# EAGLE design PIR_Sensor_Card (EAGLE 6.4)

## Sheet 1 of 2
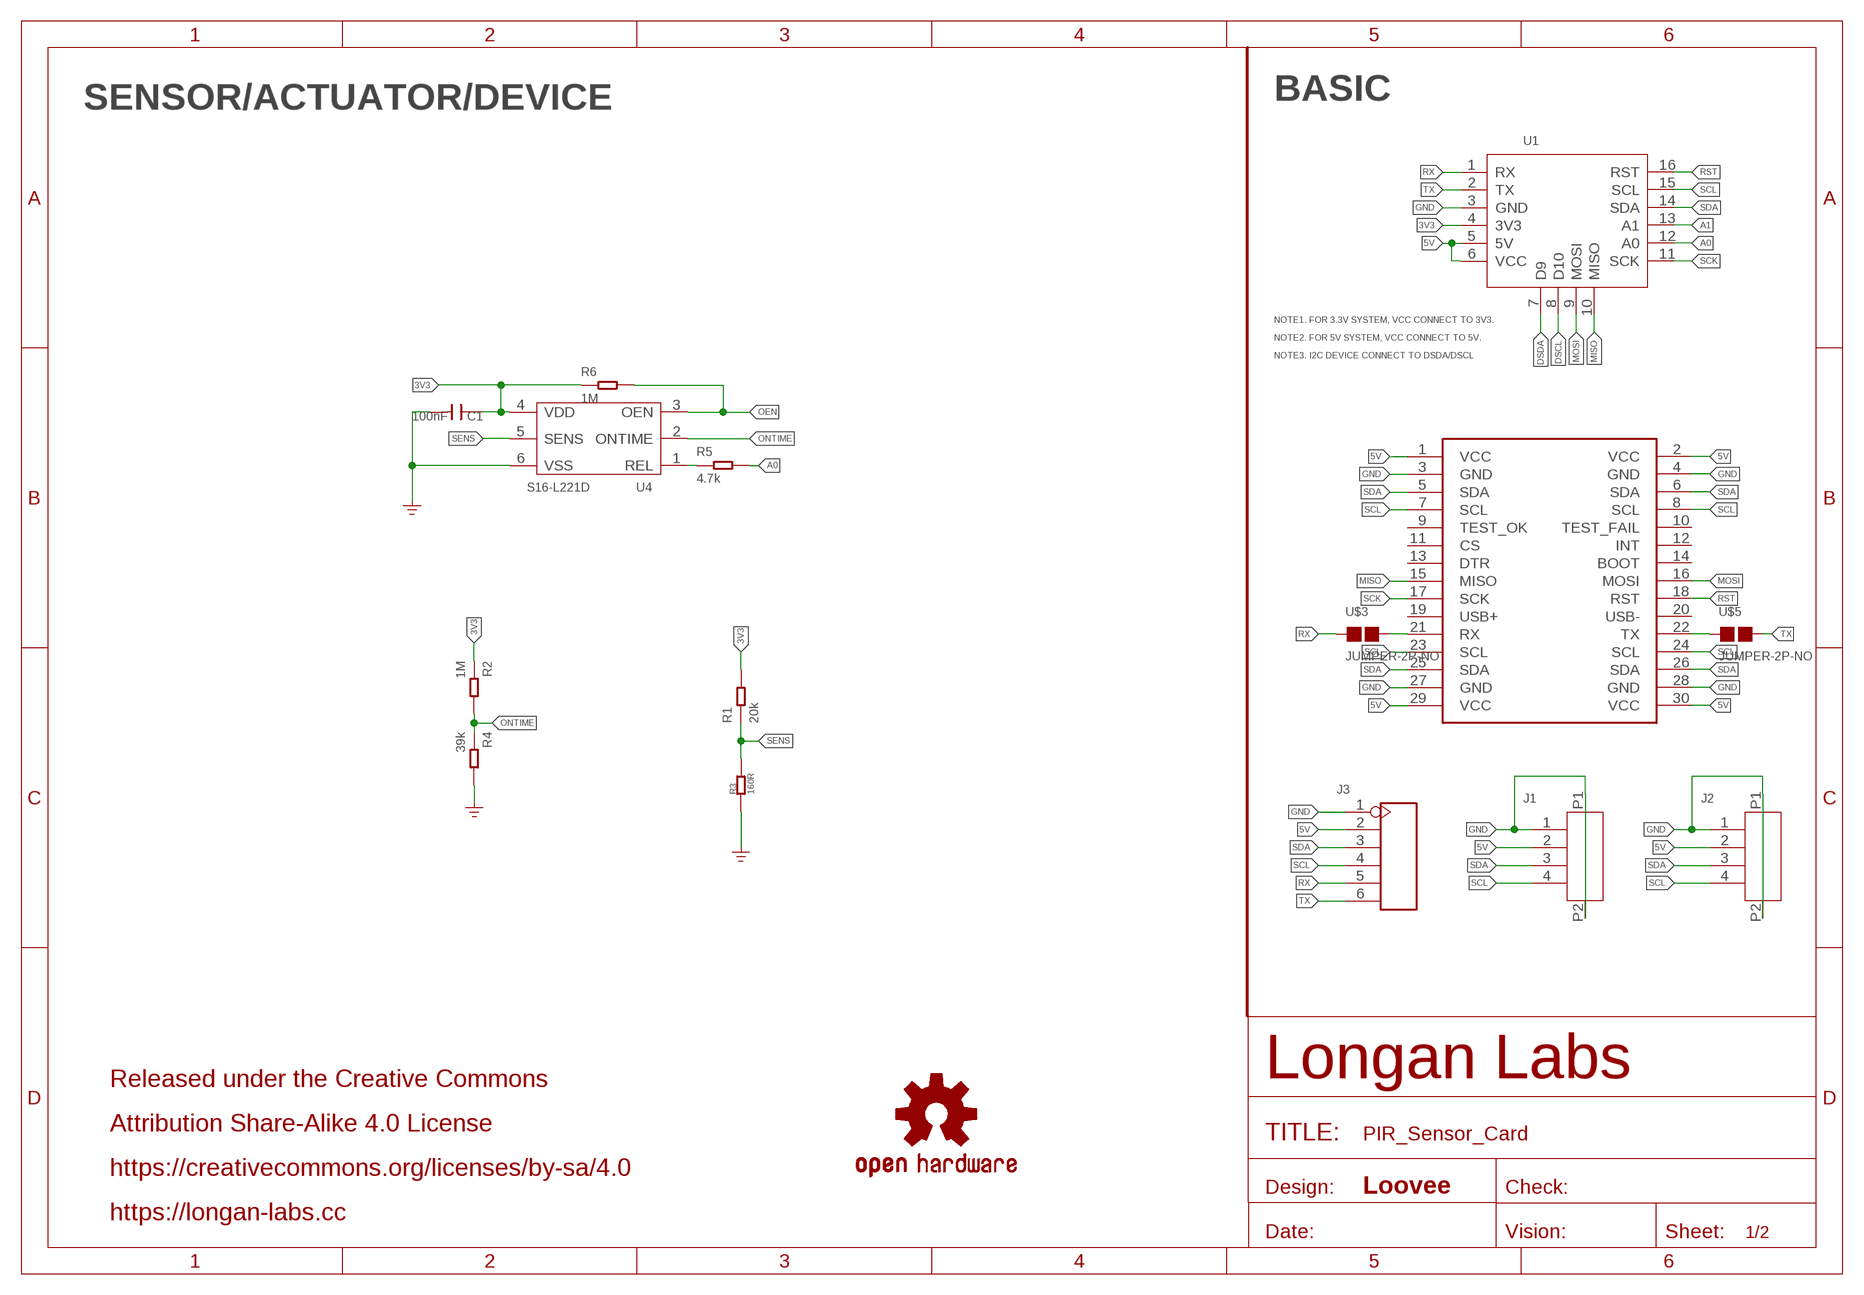
[diagram p0: schematic, sheet 1]

### Parts
C1  100nF  CAP-0603  [C0603]
J1  HEADER-4P-1.0  [4P-1.0-90D]
J2  HEADER-4P-1.0  [4P-1.0-90D]
J3  HEADER-6P-55/35MIL  [H6-2.54]
LOGO2  OSHW-LOGOS  [OSHW-LOGO-S]
MOUDLE1  MOUDLE-2X15P-2.54'BOARD'  [MOUDLE-2X15P-2.54]
R1  20k  RES-0603  [R0603]
R2  1M  RES-0603  [R0603]
R3  160R  RES-0603  [R0603]
R4  39k  RES-0603  [R0603]
R5  4.7k  RES-0603  [R0603]
R6  1M  RES-0603  [R0603]
U1  MOUDLE-CARDS  [16P-2.0-CARDS]
U4  S16-L221D  [6P-SMD-6X6MM]
U$3  JUMPER-2P-NO  [2P-SMD-NO]
U$5  JUMPER-2P-NO  [2P-SMD-NO]

### Nets
3V3: C1.1 R1.2 R2.1 R6.1 U1.4(3V3) U4.4(VDD)
5V: J1.2 J2.2 J3.2 MOUDLE1.1(VCC) MOUDLE1.2(VCC) MOUDLE1.29(VCC) MOUDLE1.30(VCC) U1.5(5V) U1.6(VCC)
A0: R5.2 U1.12(A0)
A1: U1.13(A1)
DSCL: U1.8(D10)
DSDA: U1.7(D9)
GND: C1.2 J1.1 J1.P1 J1.P2 J2.1 J2.P1 J2.P2 J3.1 MOUDLE1.3(GND) MOUDLE1.4(GND) MOUDLE1.27(GND) MOUDLE1.28(GND) R3.1 R4.2 U1.3(GND) U4.6(VSS) ; supply symbol labelled GND_POWER
MISO: MOUDLE1.15(MISO) U1.10(MISO)
MOSI: MOUDLE1.16(MOSI) U1.9(MOSI)
N$1: R5.1 U4.1(REL)
N$2: MOUDLE1.21(RX) U$3.2
N$3: MOUDLE1.22(TX) U$5.1
OEN: R6.2 U4.3(OEN)
ONTIME: R2.2 R4.1 U4.2(ONTIME)
RST: MOUDLE1.18(RST) U1.16(RST)
RX: J3.5 U1.1(RX) U$3.1
SCK: MOUDLE1.17(SCK) U1.11(SCK)
SCL: J1.4 J2.4 J3.4 MOUDLE1.7(SCL) MOUDLE1.8(SCL) MOUDLE1.23(SCL) MOUDLE1.24(SCL) U1.15(SCL)
SDA: J1.3 J2.3 J3.3 MOUDLE1.5(SDA) MOUDLE1.6(SDA) MOUDLE1.25(SDA) MOUDLE1.26(SDA) U1.14(SDA)
SENS: R1.1 R3.2 U4.5(SENS)
TX: J3.6 U1.2(TX) U$5.2
Unconnected: MOUDLE1.9(TEST_OK) MOUDLE1.10(TEST_FAIL) MOUDLE1.11(CS) MOUDLE1.12(INT) MOUDLE1.13(DTR) MOUDLE1.14(BOOT) MOUDLE1.19(USB+) MOUDLE1.20(USB-)

### Notes on the sheet
- SENSOR/ACTUATOR/DEVICE | BASIC
- NOTE1. FOR 3.3V SYSTEM, VCC CONNECT TO 3V3.
- NOTE2. FOR 5V SYSTEM, VCC CONNECT TO 5V.
- NOTE3. I2C DEVICE CONNECT TO DSDA/DSCL
- Released under the Creative Commons
- Attribution Share-Alike 4.0 License
- https://creativecommons.org/licenses/by-sa/4.0
- Loovee
- https://longan-labs.cc

## Sheet 2 of 2

## Library data of the parts
C1 = Discrete-new:CAP: Ceramic Capacitors
J1 J2 = Longan-Connect:HEADER-4P-1.0
J3 = Connector-new:HEADER-6P
LOGO2 = SparkFun-Aesthetics:OSHW-LOGO: Open-Source Hardware (OSHW) Logo This logo indicates the piece of hardware it is found on incorporates a OSHW license and/or adheres to the definition of open source hardware found here: http://freedomdefined.org/OSHW
MOUDLE1 = Longan-moudle:MOUDLE-2X15P-2.54
R1-R6 = Discrete-new:RES
U1 = MOUDLE-CARDS:MOUDLE-CARDS
U4 = template:S16-L221D
U$3 U$5 = Discrete-new:JUMPER-2P-NO

## Board
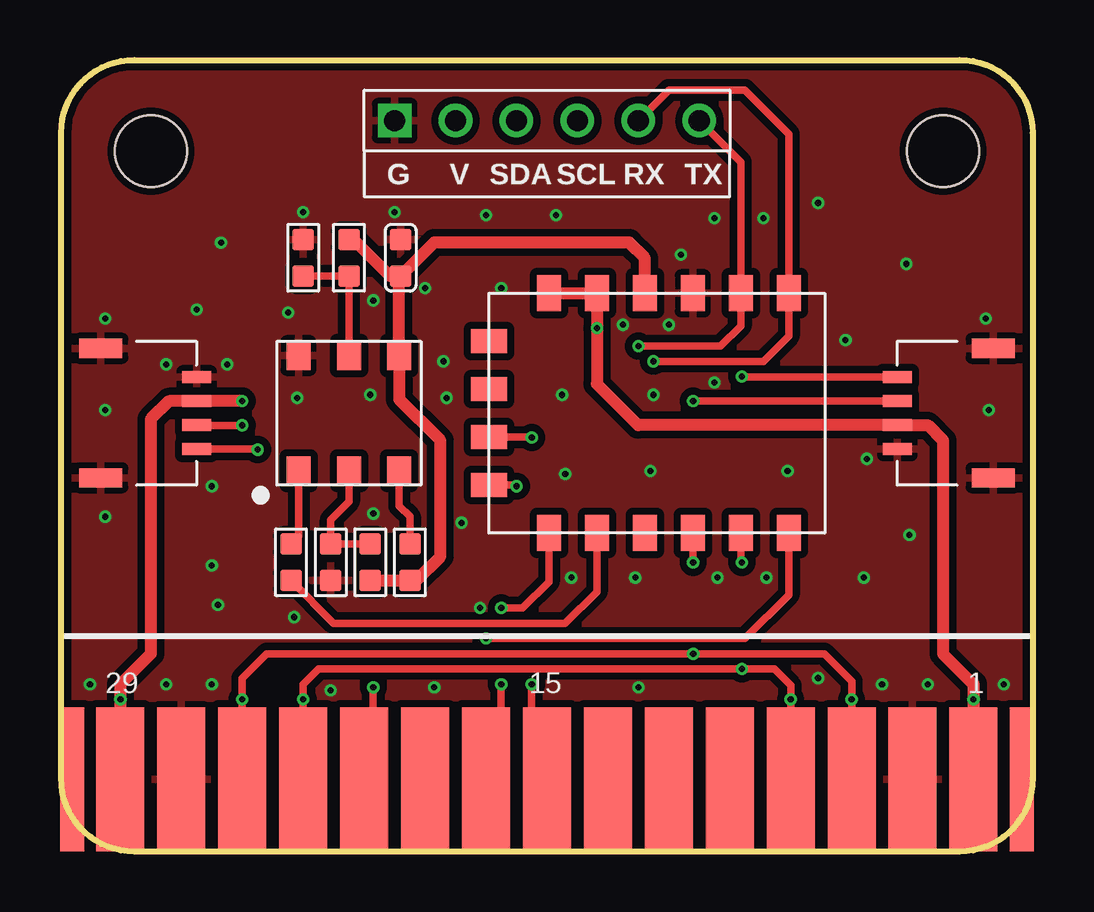
[diagram p1: board, top side]
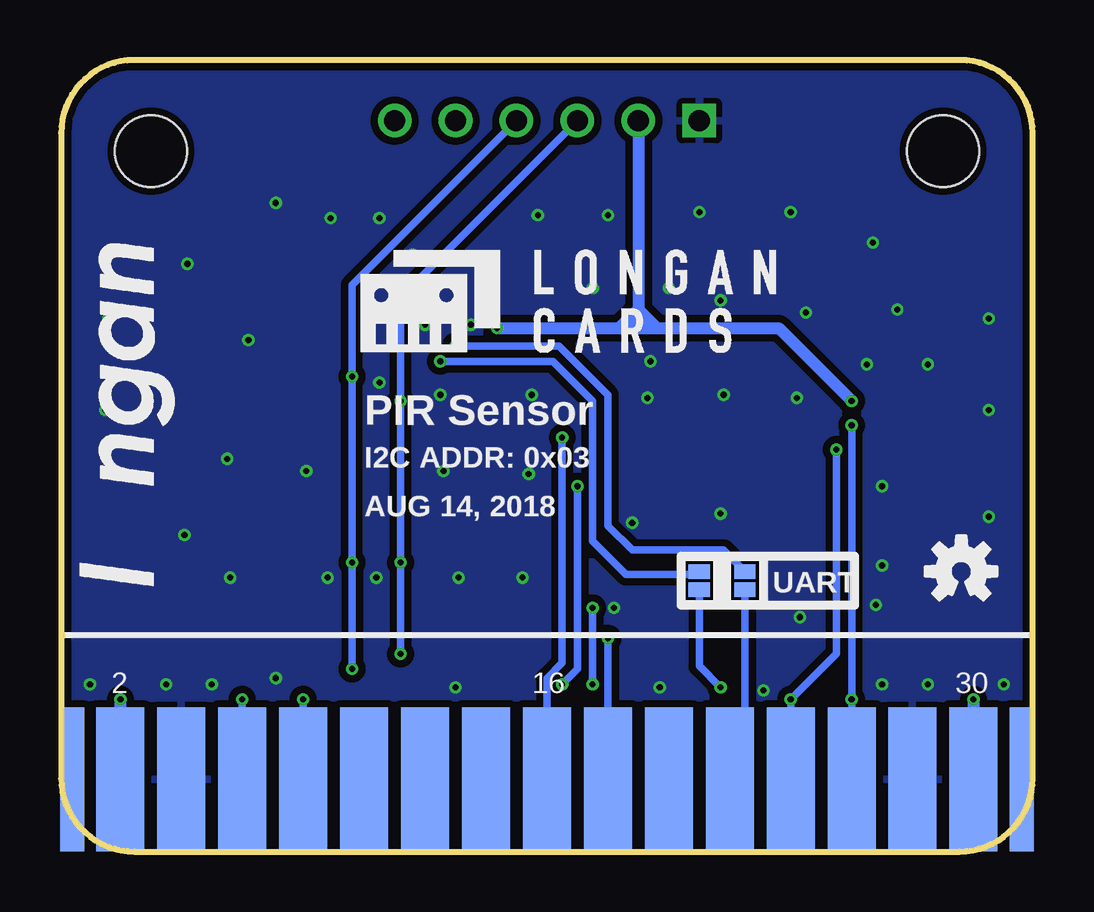
[diagram p2: board, bottom side, seen from below]

Size 40.5 x 33 mm. Coordinates in mm from the lower left corner, seen from the top.
Copper layers (1*16): Top 0.035mm / dielectric 1.5mm / Bottom 0.035mm
Design rules "SeeedStudio_2layer_DRU_no_angle_20140221": minimum track width 1mil, minimum drill 10mil, track to track 6mil, track to pad 6mil, pad to pad 6mil, via to via 6mil, smd to smd 0mil, copper to edge 10mil, drill to drill 10mil, minimum pad ring 4mil, minimum via ring 4mil, stop-mask expansion 2mil, vias tented up to drill 25mil, thermal gap 10mil

### Footprints (pad centres in the part's own frame; a part is rotated, then mirrored left to right if it is on the bottom)
C0603 = smd 0.889 x 0.889: 1 0,0.762; 2 0,-0.762
4P-1.0-90D = smd 1.2 x 0.5: 1 0,1.5; 2 0,0.5; 3 0,-0.5; 4 0,-1.5 | smd 1.8 x 0.8: P1 -4,2.7; P2 -4,-2.7
H6-2.54 = drill 0.889 pad 1.397 square: 1 0,6.35 | drill 0.889 pad 1.397: 2 0,3.81; 3 0,1.27; 4 0,-1.27; 5 0,-3.81; 6 0,-6.35
MOUDLE-2X15P-2.54 = smd 2 x 6: 1 17.78,-13.492; 3 15.24,-13.492; 5 12.7,-13.492; 7 10.16,-13.492; 9 7.62,-13.492; 11 5.08,-13.492; 13 2.54,-13.492; 15 0,-13.492; 17 -2.54,-13.492; 19 -5.08,-13.492; 21 -7.62,-13.492; 23 -10.16,-13.492; 25 -12.7,-13.492; 27 -15.24,-13.492; 29 -17.78,-13.492 | smd 2 x 6 bottom: 2 17.78,-13.492; 4 15.24,-13.492; 6 12.7,-13.492; 8 10.16,-13.492; 10 7.62,-13.492; 12 5.08,-13.492; 14 2.54,-13.492; 16 0,-13.492; 18 -2.54,-13.492; 20 -5.08,-13.492; 22 -7.62,-13.492; 24 -10.16,-13.492; 26 -12.7,-13.492; 28 -15.24,-13.492; 30 -17.78,-13.492 | smd 1 x 6: P1 -19.8,-13.492; P4 19.8,-13.492 | smd 1 x 6 bottom: P2 -19.8,-13.492; P3 19.8,-13.492 | hole 3: -16.51,12.7; 16.51,12.7
R0603 = smd 0.889 x 0.889: 1 0,0.762; 2 0,-0.762
16P-2.0-CARDS = smd 1.5 x 1: 1 -5,5; 2 -5,3; 3 -5,1; 4 -5,-1; 5 -5,-3; 6 -5,-5; 11 5,-5; 12 5,-3; 13 5,-1; 14 5,1; 15 5,3; 16 5,5 | smd 1 x 1.5: 7 -3,-7.5; 8 -1,-7.5; 9 1,-7.5; 10 3,-7.5
6P-SMD-6X6MM = smd 1.2 x 1: 1 -2.4,2.1; 2 -2.4,0; 3 -2.4,-2.1; 4 2.4,-2.1; 5 2.4,0; 6 2.4,2.1
2P-SMD-NO = smd 0.889 x 0.61: 1 0,0.381; 2 0,-0.381

### Placement (x,y rotation side)
C1  14.15,24.76 180 top
J1  5.64,18.28 0 top
J2  34.86,18.28 180 top
J3  20.25,30.47 90 top
LOGO2  2.98,11.67 0 bottom
MOUDLE1  20.25,16.5 0 top
R1  11.99,24.76 180 top
R2  12.88,12.05 180 top
R3  10.09,24.76 0 top
R4  11.23,12.05 0 top
R5  9.58,12.05 0 top
R6  14.54,12.05 180 top
U1  25.33,18.28 270 top
U4  11.99,18.28 90 top
U$1  [LONGAN-CARDS-MIDDLE]  28.76,20.31 0 bottom
U$3  13.9,11.29 0 bottom
U$5  11.99,11.29 180 bottom
U$7  [LONGAN-COPPER-SMALLER]  34.6,9.77 90 bottom

### Tracks (layer width: path | path; a pad name or v marks a point on that pad's centre or on a via)
3V3
  Top 0.508: C1.1 14.09,23.81 U4.4 14.09,18.84 15.8,17.14 15.8,12.31 14.79,11.29 R6.1 R2.1 | U1.4 24.33,24.74 23.68,25.39 15.55,25.39 C1.1 | R1.2 12.19,25.52 13.71,23.99 C1.1
5V  (via drill 0.25 pad 0.51)
  Top 0.508: 22.28,23.23 U1.5 | U1.6 U1.5 | MOUDLE1.2 v38.03,6.34 38.03,6.97 36.76,8.24 36.76,17.14 36.12,17.78 J2.2 24.05,17.78 22.33,19.5 v22.33,21.82 U1.5 | MOUDLE1.30 v2.47,6.34 2.47,6.97 3.74,8.24 3.74,18.02 4.49,18.78 J1.2 5.65,18.79 v7.55,18.79
  Bottom 0.508: v38.03,6.34 MOUDLE1.2 | v2.47,6.34 MOUDLE1.30 | v22.33,21.82 16.44,21.82 | 16.44,21.82 10.58,21.82 v7.55,18.79 | J3.2 16.44,22.47 | 16.44,22.47 16.44,21.82 | 16.44,22.47 16.57,22.47 17.2,21.83 | 16.44,22.47 16.31,22.47 15.68,21.83
A0
  Top 0.305: U1.12 22.33,10.83 21.01,9.52 11.36,9.52 R5.2
GND  (via drill 0.25 pad 0.51)
  other vias: 4.38,6.97 6.28,6.97 1.2,6.97 34.22,6.97 36.12,6.97 39.3,6.97 24.7,19.04 27.23,19.55 33.59,16.37 38.66,18.41 35.36,13.2 38.54,22.21 32.7,21.33 27.23,26.41 25.84,24.88 20.63,26.53 17.71,26.53 13.9,26.66 10.09,26.66 15.17,23.48 18.34,23.48 25.33,21.96 23.43,21.96 20.89,19.04 13.01,22.98 1.84,18.41 6.91,20.31 1.84,22.21 4.38,20.31 1.84,13.96 6.28,15.23 6.28,11.93 21.27,11.42 23.93,11.42 27.36,11.42 29.39,11.42 33.46,11.42 30.28,15.87 24.57,15.87 21.01,15.74 9.46,22.47 6.66,25.39 5.64,22.6 31.55,27.04 35.24,24.5 15.93,20.44 16.06,18.91 9.84,18.91 12.88,19.04 16.69,13.71 13.01,14.09 9.71,9.77 6.53,10.28 29.27,26.41 24.06,6.85 17.46,10.15 15.55,6.85 11.23,6.72 31.55,7.23
  pour Top (isolate 0.305): -0.2,33.01 41.2,33.01 41.2,-0.01 -0.2,-0.01
  pour Bottom (isolate 0.305): -0.2,33.01 41.2,33.01 41.2,-0.01 -0.2,-0.01
MISO  (via drill 0.25 pad 0.51)
  Top 0.305: U1.10 18.93,15.28 v18.98,15.23 | v19.61,6.97 19.61,3.64 MOUDLE1.15
  Bottom 0.305: v18.98,15.23 18.98,7.61 v19.61,6.97
MOSI  (via drill 0.25 pad 0.51)
  Top 0.305: U1.9 19.6,17.28 v19.61,17.26
  Bottom 0.305: v19.61,17.26 19.61,7.86 20.25,7.23 MOUDLE1.16
N$1
  Top 0.305: U4.1 9.89,13.13 R5.1
N$2  (via drill 0.25 pad 0.51)
  Top 0.305: v13.01,6.85 13.01,3.39 MOUDLE1.21
  Bottom 0.305: U$3.2 13.9,7.74 v13.01,6.85
N$3
  Bottom 0.305: U$5.1 11.99,3.64 MOUDLE1.22
OEN
  Top 0.305: U4.3 14.09,14.4 14.54,13.96 R6.2
ONTIME
  Top 0.305: R2.2 R4.1 11.23,13.83 11.99,14.6 U4.2
RST  (via drill 0.25 pad 0.51)
  Top 0.305: U1.16 30.33,10.71 28.51,8.88 v17.71,8.88
  Bottom 0.305: v17.71,8.88 MOUDLE1.18
RX  (via drill 0.25 pad 0.51)
  Top 0.305: J3.5 25.33,31.74 28.51,31.74 30.33,29.91 U1.1 30.33,21.5 29.27,20.44 v24.7,20.44
  Bottom 0.305: v24.7,20.44 20,20.44 18.34,18.79 18.34,12.94 16.95,11.55 14.03,11.55 U$3.1
SCK  (via drill 0.25 pad 0.51)
  Top 0.305: U1.11 20.33,11.25 19.23,10.15 v18.34,10.15 | v18.34,6.97 18.34,3.64 MOUDLE1.17
  Bottom 0.305: v18.34,10.15 v18.34,6.97
SCL  (via drill 0.25 pad 0.51)
  Top 0.305: MOUDLE1.8 v30.41,6.34 30.41,6.93 29.73,7.61 v28.38,7.61 10.72,7.61 10.09,6.97 v10.09,6.34 MOUDLE1.23 | U1.15 28.33,12.1 v28.38,12.05 | J2.4 28.4,19.78 v28.38,19.8 | J1.4 8.16,16.78 v8.19,16.75
  Bottom 0.305: MOUDLE1.23 v10.09,6.34 8.19,8.24 v8.19,16.75 | v30.41,6.34 MOUDLE1.8 | J3.4 28.38,23.61 v28.38,19.8 v28.38,12.05 v28.38,7.61
SDA  (via drill 0.25 pad 0.51)
  Top 0.305: MOUDLE1.6 v32.95,6.34 32.95,7.1 31.81,8.24 v26.35,8.24 8.57,8.24 7.55,7.23 v7.55,6.34 MOUDLE1.25 | U1.14 26.33,12.07 v26.35,12.05 | J2.3 26.35,18.78 v26.35,18.79 | v7.55,17.77 5.65,17.77 J1.3
  Bottom 0.305: v7.55,6.34 MOUDLE1.25 v7.55,17.77 | v32.95,6.34 MOUDLE1.6 | J3.3 26.35,23.1 v26.35,18.79 v26.35,12.05 v26.35,8.24
SENS
  Top 0.305: U4.5 R1.1 R3.2
TX  (via drill 0.25 pad 0.51)
  Top 0.305: J3.6 28.33,28.74 U1.2 28.33,21.91 27.49,21.07 v24.06,21.07
  Bottom 0.305: v24.06,21.07 19.74,21.07 17.71,19.04 17.71,13.58 16.69,12.56 12.88,12.56 U$5.2

### Text on the board
tPlace: G | V | SDA | SCL | RX | TX
bPlace: PIR Sensor | I2C ADDR: 0x03 | AUG 14, 2018 | UART